# EasyEDA Pro project Link.epro

# Schematic ST-Link_v1_3
Board Name: ST-Link_v1_3; Create Date: 2025-02-25; Page Name: ST-Link; Project Name: ST-Link; Schematic Name: ST-Link_v1_3; Update Date: 2025-02-26
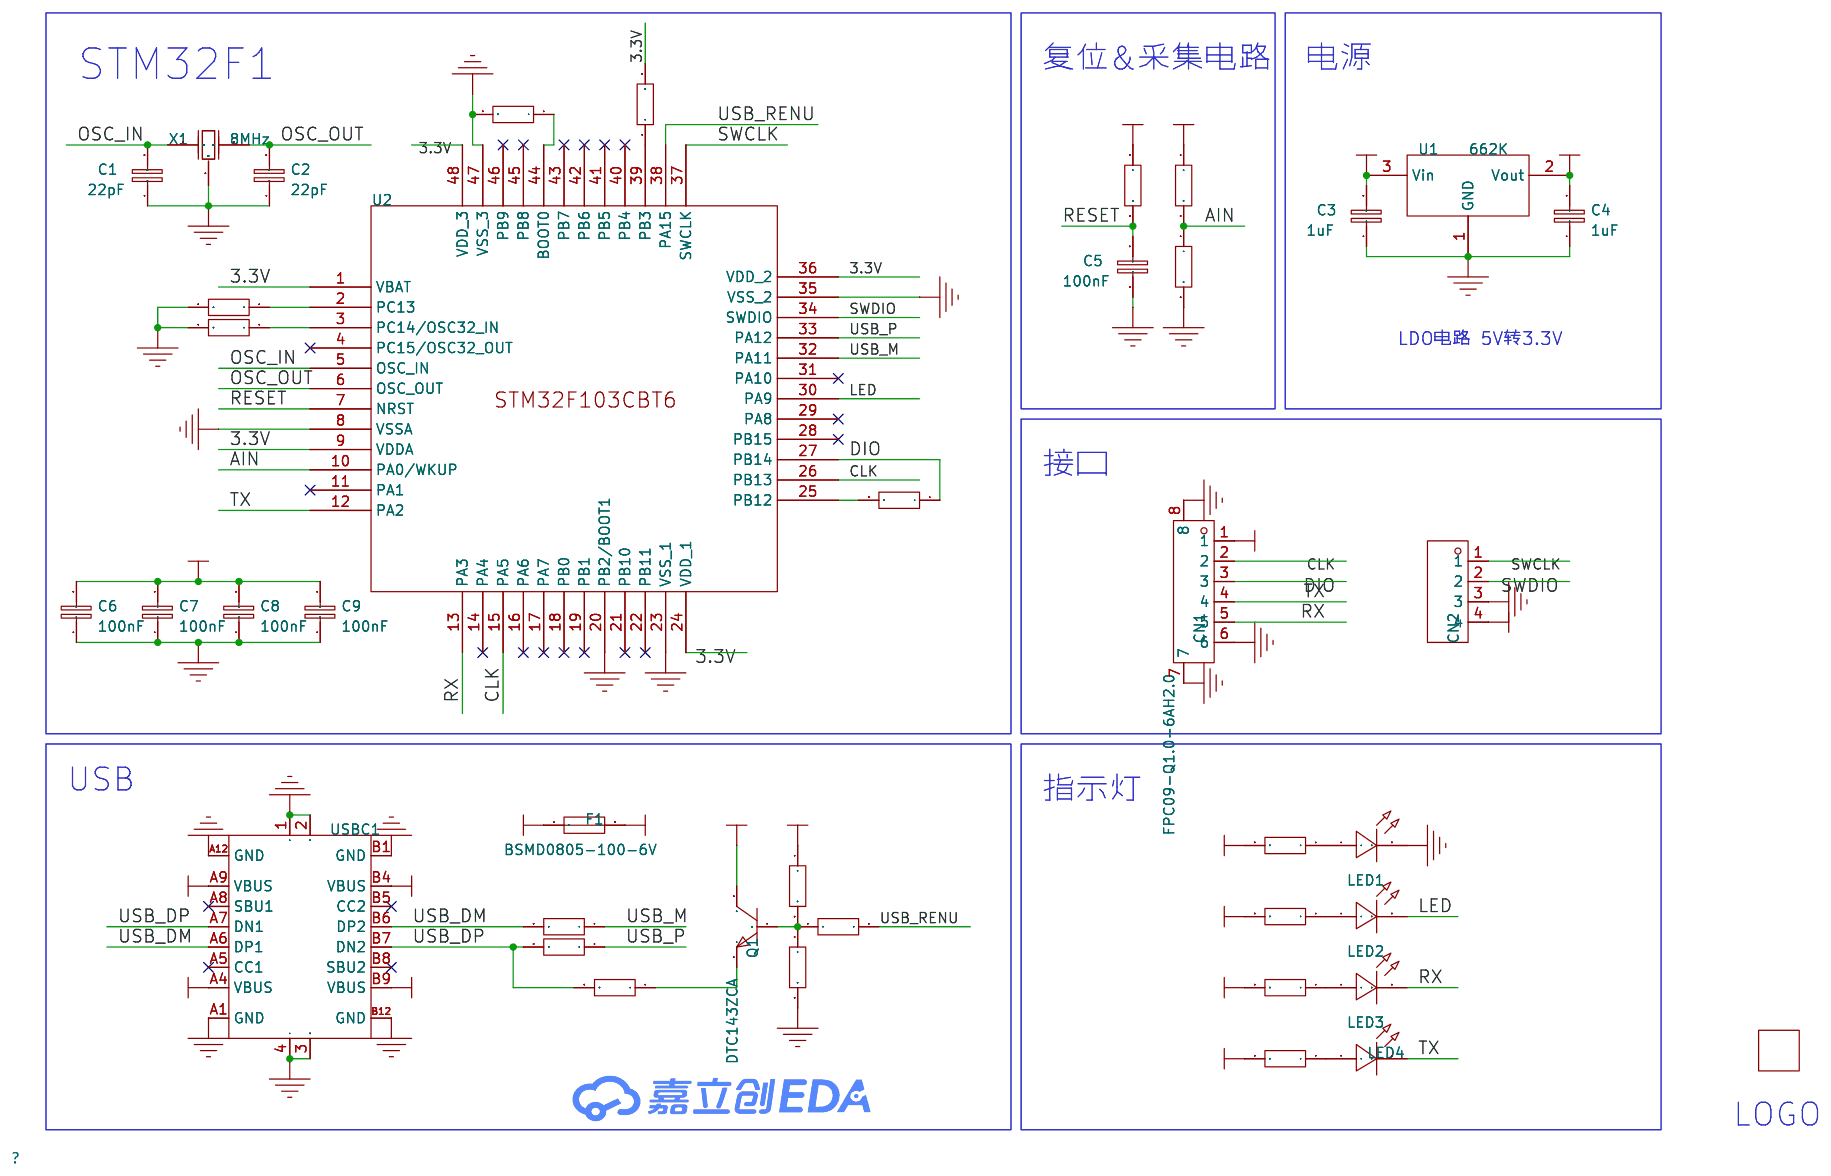
[diagram p0: schematic sheet]

## Parts
C1  22pF  [C0603]
C2  22pF  [C0603]
C3  1uF  [C0603]
C4  1uF  [C0603]
C5  100nF  [C0603]
C6  100nF  [C0603]
C7  100nF  [C0603]
C8  100nF  [C0603]
C9  100nF  [C0603]
CN1  FPC09-Q1.0-6AH2.0  [FPC-SMD_6P-P1.00_XYECONN_FPC09-Q1.0-6AH2.0]
CN2  X6511WRS-04H-C60D48  [HDR-SMD_4P-P2.54-H-M-W13.3-N]
F1  BSMD0805-100-6V  [F0805]
H1  MoonGrt  [MoonGrt]  (no BOM)
LED1  LTST-C193TBKT-5A  [LED0603]
LED2  LTST-C193TBKT-5A  [LED0603]
LED3  LTST-C193TBKT-5A  [LED0603]
LED4  LTST-C193TBKT-5A  [LED0603]
Q1  DTC143ZCA  [SOT-23-3_L2.9-W1.3-P1.90-LS2.4-BR]
R1  4.7kΩ  [R0603]
R2  10kΩ  [R0603]
R3  10kΩ  [R0603]
R4  10kΩ  [R0603]
R5  10kΩ  [R0603]
R6  10kΩ  [R0603]
R7  10kΩ  [R0603]
R8  100Ω  [R0603]
R9  1kΩ  [R0603]
R10  10kΩ  [R0603]
R11  22Ω  [R0603]
R12  22Ω  [R0603]
R13  100Ω  [R0603]
R14  1kΩ  [R0603]
R15  36kΩ  [R0603]
R16  1.5kΩ  [R0603]
R17  1kΩ  [R0603]
R18  1kΩ  [R0603]
U1  662K  [SOT-23-3_L2.9-W1.3-P1.90-LS2.4-BR]
U2  STM32F103CBT6  [LQFP-48_L7.0-W7.0-P0.50-LS9.0-BL]
USBC1  TYPE-C-31-M-12  [USB-C_SMD-TYPE-C-31-M-12]
X1  8MHz  [OSC-SMD_3P-L3.2-W1.3-P1.20-L]

## Library data of the parts
C1 C2 = CL10C220JB8NNNC: 容值:22pF;精度:±5%;额定电压:50V;材质(温度系数):C0G;; LCSC Part Name: 22pF ±5% 50V; Supplier Part: C1653; Manufacturer: SAMSUNG(三星); Supplier Footprint: 0603; JLCPCB Part Class: Basic Part; Datasheet: https://atta.szlcsc.com/upload/public/pdf/source/20160218/1457707763339.pdf; Supplier: LCSC; Tolerance: ±5%; Voltage Rated: 50V; Temperature Coefficient: C0G
C3 C4 C6-C9 = CL10A106KP8NNNC: 容值:10uF;精度:±10%;额定电压:10V;材质(温度系数):X5R;; LCSC Part Name: 10uF ±10% 10V; Supplier Part: C19702; Manufacturer: SAMSUNG(三星); Supplier Footprint: 0603; JLCPCB Part Class: Basic Part; Datasheet: https://atta.szlcsc.com/upload/public/pdf/source/20160218/1457707763339.pdf; Supplier: LCSC; Tolerance: ±10%; Voltage Rated: 10V; Temperature Coefficient: X5R
C5 = CC0603KRX7R9BB104: 容值:100nF;精度:±10%;额定电压:50V;材质(温度系数):X7R;; LCSC Part Name: 100nF ±10% 50V; Supplier Part: C14663; Manufacturer: YAGEO(国巨); Supplier Footprint: 0603; JLCPCB Part Class: Basic Part; Datasheet: https://atta.szlcsc.com/upload/public/pdf/source/20180910/C282072_33301C7F631E79921B82A8DAC6BCC5B3.pdf; Supplier: LCSC; Tolerance: ±10%; Voltage Rated: 50V; Temperature Coefficient: X7R
CN1 = FPC09-Q1.0-6AH2.0: 锁定特性:翻盖式;触点类型:下接;触点数量:6P;间距:1mm;安装类型:卧贴;; LCSC Part Name: 间距:1mm P数:6P 翻盖式 下接; Supplier Part: C19269921; Manufacturer: XYECONN(辛译); Supplier Footprint: SMD,P=1mm,卧贴; JLCPCB Part Class: Extended Part; Datasheet: https://atta.szlcsc.com/upload/public/pdf/source/20231122/290E50ABEF878A57FE1C34FD27D651A8.pdf; Supplier: LCSC; Locking Feature: 翻盖式; Contact Type: 下接; Number of Contacts: 6P; Pitch: 1mm; Mounting Type: 卧贴; Height Above Board: 2mm
CN2 = X6511WRS-04H-C60D48: 插针结构:1x4P;间距:2.54mm;行距:2.54mm;圆针/方针:方针;安装类型:-;排数:单排;总PIN位数:4P;额定电流:3A;额定电压:250V;配合针长度:-;塑高:2.5mm;端接针长度:-;触头材质:黄铜;触头镀层:金;工作温度范围:-40℃~+105℃;焊接温度(最大值):260℃;颜色:黑色;; LCSC Part Name: 1x4P 间距:2.54mm 方针; Supplier Part: C5242197; Manufacturer: XKB Connection(中国星坤); Supplier Footprint: SMD,P=2.54mm; JLCPCB Part Class: 扩展库; Datasheet: https://atta.szlcsc.com/upload/public/pdf/source/20221103/EADF72CF36CD96D511D8188ACEE72315.pdf; Supplier: LCSC; Pin Structure: 1x4P; Pitch: 2.54mm; Row Spacing: 2.54mm; Circluar Pins/Square Pins: 方针; Number of Rows: 单排; Number of Pins: 4P; Current Rating (Max): 3A; Voltage Rating (Max): 250V; Insulation Height: 2.5mm; Contact Material: 黄铜; Contact Plating: 金; Operating Temperature Range: -40℃~+105℃; Soldering Temperature(Max): 260℃; Color: 黑色
F1 = BSMD0805-100-6V: 最大电压:6V;最大电流:40A;保持电流:1A;跳闸电流:2A;; LCSC Part Name: 6V 1A 0805自恢复; Supplier Part: C883112; Manufacturer: BHFUSE(佰宏); Supplier Footprint: 0805; JLCPCB Part Class: Extended Part; Datasheet: https://atta.szlcsc.com/upload/public/pdf/source/20230512/7A46D6CD923C15CBB98FD769C08EDD80.pdf; Supplier: LCSC; Operating Voltage (Max): 6V; Current Rating (Max): 40A; Hold Current: 1A; Trip Current: 2A; Power Dissipation: 600mW; Resistance - Initial (Ri) (Min): 40mΩ; Resistance - Post Trip (R1) (Max): 270mΩ; Maximum Time to Trip: 300ms; Operating Temperature: -40℃~+85℃
H1 = MoonGrt
LED1-LED4 = LTST-C193TBKT-5A: 发光颜色:蓝色;正向电压(VF):2.8V;功率:76mW;正向电流:5mA;主波长:465nm~475nm;二极管配置:-;透镜颜色:无色透明透镜;色温:-;发光强度:15mcd;发光角度:130°;载带方式:-;工作温度:-20℃~+80℃;; LCSC Part Name: 蓝灯; Supplier Part: C125103; Manufacturer: LITEON(光宝); Supplier Footprint: 0603; JLCPCB Part Class: Extended Part; Datasheet: https://atta.szlcsc.com/upload/public/pdf/source/20171230/C125103_15146280496221222053.pdf; Supplier: LCSC; Emitted Color: 蓝色; Forward Voltage (VF): 2.8V; Power Dissipation: 76mW; Forward Current: 5mA; Dominant Wavelength: 465nm~475nm; Peak Wavelength: 468nm; Lens Color: 无色透明透镜; Luminous Intensity: 15mcd; Viewing Angle: 130°; Operating Temperature: -20℃~+80℃
Q1 = DTC143ZCA_C15236: 晶体管类型:-;集射极击穿电压(Vceo):50V;集电极电流(Ic):100mA;功率(Pd):200mW;直流电流增益(hFE@Ic,Vce):80@10mA,5V;; LCSC Part Name: 耐压:50V 电流:100mA; Supplier Part: C15236; Manufacturer: CJ(江苏长电/长晶); Supplier Footprint: SOT-23; JLCPCB Part Class: Extended Part; Datasheet: https://atta.szlcsc.com/upload/public/pdf/source/20140809/1457707205046.pdf; Supplier: LCSC; Collector-Emitter Breakdown Voltage (Vceo): 50V; Collector Current (Ic): 100mA; Power Dissipation (Pd): 200mW; DC Current Gain (hFE@Ic,Vce): 80@10mA,5V; Input Voltage (VI(on)@Ic,Vce): 1.3V@5mA,0.3V; Input Voltage (VI(off)@Ic,Vce): 500mV; Output Voltage (VO(on)@Io/Ii): 300mV@5mA,0.25mA; Input Resistor: 6.11kΩ; Operating Temperature: -55℃~+150℃
R1 = 0603WAF4701T5E: 电阻类型:厚膜电阻;阻值:4.7kΩ;精度:±1%;功率:100mW;最大工作电压:75V;温度系数:±100ppm/℃;; LCSC Part Name: 4.7kΩ ±1% 100mW 厚膜电阻; Supplier Part: C23162; Manufacturer: UNI-ROYAL(厚声); Supplier Footprint: 0603; JLCPCB Part Class: Basic Part; Datasheet: https://atta.szlcsc.com/upload/public/pdf/source/20200306/C422600_1E6D84923E4A46A82E41ADD87F860B5C.pdf; Supplier: LCSC; Type: 厚膜电阻; Tolerance: ±1%; Power(Watts): 100mW; Overload Voltage (Max): 75V; Temperature Coefficient: ±100ppm/℃; Operating Temperature Range: -55℃~+155℃
R2-R7 R10 = 0603WAF1002T5E: 电阻类型:厚膜电阻;阻值:10kΩ;精度:±1%;功率:100mW;最大工作电压:75V;温度系数:±100ppm/℃;; LCSC Part Name: 厚膜电阻 10kΩ ±1% 100mW; Supplier Part: C25804; Manufacturer: UNI-ROYAL(厚声); Supplier Footprint: 0603; JLCPCB Part Class: Basic Part; Datasheet: https://atta.szlcsc.com/upload/public/pdf/source/20200306/C422600_1E6D84923E4A46A82E41ADD87F860B5C.pdf; Supplier: LCSC; Type: 厚膜电阻; Tolerance: ±1%; Power(Watts): 100mW; Overload Voltage (Max): 75V; Temperature Coefficient: ±100ppm/℃; Operating Temperature Range: -55℃~+155℃
R8 R13 = 0603WAF1000T5E: 电阻类型:厚膜电阻;阻值:100Ω;精度:±1%;功率:100mW;最大工作电压:75V;温度系数:±200ppm/℃;; LCSC Part Name: 100Ω ±1% 100mW 厚膜电阻; Supplier Part: C22775; Manufacturer: UNI-ROYAL(厚声); Supplier Footprint: 0603; JLCPCB Part Class: Basic Part; Datasheet: https://atta.szlcsc.com/upload/public/pdf/source/20200306/C422600_1E6D84923E4A46A82E41ADD87F860B5C.pdf; Supplier: LCSC; Type: 厚膜电阻; Tolerance: ±1%; Power(Watts): 100mW; Overload Voltage (Max): 75V; Temperature Coefficient: ±200ppm/℃; Operating Temperature Range: -55℃~+155℃
R9 R14 R17 R18 = 0603WAF1001T5E: 电阻类型:厚膜电阻;阻值:1kΩ;精度:±1%;功率:100mW;最大工作电压:75V;温度系数:±100ppm/℃;; LCSC Part Name: 1kΩ ±1% 100mW 厚膜电阻; Supplier Part: C21190; Manufacturer: UNI-ROYAL(厚声); Supplier Footprint: 0603; JLCPCB Part Class: Basic Part; Datasheet: https://atta.szlcsc.com/upload/public/pdf/source/20200306/C422600_1E6D84923E4A46A82E41ADD87F860B5C.pdf; Supplier: LCSC; Type: 厚膜电阻; Tolerance: ±1%; Power(Watts): 100mW; Overload Voltage (Max): 75V; Temperature Coefficient: ±100ppm/℃; Operating Temperature Range: -55℃~+155℃
R11 R12 = 0603WAF220JT5E: 电阻类型:厚膜电阻;阻值:22Ω;精度:±1%;功率:100mW;最大工作电压:75V;温度系数:±100ppm/℃;; LCSC Part Name: 22Ω ±1% 100mW 厚膜电阻; Supplier Part: C23345; Manufacturer: UNI-ROYAL(厚声); Supplier Footprint: 0603; JLCPCB Part Class: Basic Part; Datasheet: https://atta.szlcsc.com/upload/public/pdf/source/20200306/C422600_1E6D84923E4A46A82E41ADD87F860B5C.pdf; Supplier: LCSC; Type: 厚膜电阻; Tolerance: ±1%; Power(Watts): 100mW; Overload Voltage (Max): 75V; Temperature Coefficient: ±100ppm/℃; Operating Temperature Range: -55℃~+155℃
R15 = 0603WAF3602T5E: 电阻类型:厚膜电阻;阻值:36kΩ;精度:±1%;功率:100mW;最大工作电压:75V;温度系数:±100ppm/℃;; LCSC Part Name: 36kΩ ±1% 100mW 厚膜电阻; Supplier Part: C23147; Manufacturer: UNI-ROYAL(厚声); Supplier Footprint: 0603; JLCPCB Part Class: Extended Part; Datasheet: https://atta.szlcsc.com/upload/public/pdf/source/20200306/C422600_1E6D84923E4A46A82E41ADD87F860B5C.pdf; Supplier: LCSC; Type: 厚膜电阻; Tolerance: ±1%; Power(Watts): 100mW; Overload Voltage (Max): 75V; Temperature Coefficient: ±100ppm/℃; Operating Temperature Range: -55℃~+155℃
R16 = 0603WAF1501T5E: 电阻类型:厚膜电阻;阻值:1.5kΩ;精度:±1%;功率:100mW;最大工作电压:75V;温度系数:±100ppm/℃;; LCSC Part Name: 1.5kΩ ±1% 100mW 厚膜电阻; Supplier Part: C22843; Manufacturer: UNI-ROYAL(厚声); Supplier Footprint: 0603; JLCPCB Part Class: Basic Part; Datasheet: https://atta.szlcsc.com/upload/public/pdf/source/20200306/C422600_1E6D84923E4A46A82E41ADD87F860B5C.pdf; Supplier: LCSC; Type: 厚膜电阻; Tolerance: ±1%; Power(Watts): 100mW; Overload Voltage (Max): 75V; Temperature Coefficient: ±100ppm/℃; Operating Temperature Range: -55℃~+155℃
U1 = 662K: 输出类型:固定;最大输入电压:8V;输出电压:3.3V;最大输出电流:300mA;输出极性:正极;; LCSC Part Name: 662K. 输入8V 300mA; Supplier Part: C7470756; Manufacturer: HXY MOSFET(华轩阳电子); Supplier Footprint: SOT-23; JLCPCB Part Class: Extended Part; Datasheet: https://atta.szlcsc.com/upload/public/pdf/source/20230915/BA72989D17401E2852D389BF12EDF43F.pdf; Supplier: LCSC; Output Type: 固定; Maximum Input Voltage: 8V; Output Voltage: 3.3V; MAX Output Current: 300mA; Output Polarity: 正极; Number of Outputs: 1; Design Item ID: LM317; Library Name: fly
U2 = STM32F103CBT6: CPU内核:ARM-M3;CPU最大主频:72MHz;应用领域:-;; LCSC Part Name: 主流增强型ARM Cortex-M3 MCU，具有128 KB Flash、72 MHz CPU、电机控制、USB和CAN; Supplier Part: C8304; Manufacturer: ST(意法半导体); Supplier Footprint: LQFP-48(7x7); JLCPCB Part Class: Extended Part; Datasheet: https://atta.szlcsc.com/upload/public/pdf/source/20150811/1457707344439.pdf; Supplier: LCSC; CPU Core: ARM-M3; CPU Maximum Speed: 72MHz; Program Storage Size: 128KB; Program Memory Type: FLASH; Number of I/O: 37; ADC (Bit): 12bit; Low Voltage Detection Threshold: 2V~3.6V
USBC1 = TYPE-C-31-M-12: 连接器类型:Type-C;标准:-;公母:母;安装方式:-;触点数量:16P;端口数量:1;额定电流 - 电源:5A;工作温度范围:-;; LCSC Part Name: Type-C 母; Supplier Part: C165948; Manufacturer: 韩国韩荣; Supplier Footprint: SMD; JLCPCB Part Class: Extended Part; Datasheet: https://atta.szlcsc.com/upload/public/pdf/source/20220525/466408E853115E789EDB0DDC29077C05.pdf; Supplier: LCSC; Connector Type: Type-C; Gender: 母; Number of Contacts: 16P; Number of Ports: 1; Current Rating - Power (Max): 5A
X1 = CSTNE8M00GH5C000R0: 频率:8MHz;内置负载电容:33pF;谐振阻抗:40Ω;; LCSC Part Name: 8MHz ±0.07% 内置负载电容:33pF; Supplier Part: C341525; Manufacturer: muRata(村田); Supplier Footprint: SMD3213-3P; JLCPCB Part Class: Extended Part; Datasheet: https://atta.szlcsc.com/upload/public/pdf/source/20181211/C341525_832BA077079E4863A5153C1DB98581D5.pdf; Supplier: LCSC; Built-in Load Capacitance: 33pF; Resonant Impedance: 40Ω; Operating Temperature: -40℃~+125℃

## Nets
3.3V: C4.2 C6.2 C7.2 C8.2 C9.2 CN1.1 CN2.4 Q1.3(C) R1.2 R3.1 R4.1 R9.2 R14.2 R17.2 R18.2 U1.2(Vout) U2.1(VBAT) U2.9(VDDA) U2.24(VDD_1) U2.36(VDD_2) U2.48(VDD_3)
5V: C3.2 F1.2 R10.1 U1.3(Vin)
GND: C1.1 C2.1 C3.1 C4.1 C5.1 C6.1 C7.1 C8.1 C9.1 CN1.6 CN1.7 CN1.8 CN2.3 LED1.2 R2.2 R5.2 R6.2 R7.2 R15.2 U1.1(GND) U2.8(VSSA) U2.20(PB2/BOOT1) U2.23(VSS_1) U2.35(VSS_2) U2.47(VSS_3) USBC1.1 USBC1.2 USBC1.3 USBC1.4 USBC1.A1(GND) USBC1.A12(GND) USBC1.B1(GND) USBC1.B12(GND) X1.2(GND)
VBUS: F1.1 USBC1.A4(VBUS) USBC1.A9(VBUS) USBC1.B4(VBUS) USBC1.B9(VBUS)
AIN: R4.2 R5.1 U2.10(PA0/WKUP)
CLK: CN1.2 U2.15(PA5) U2.26(PB13)
DIO: CN1.3 R8.1 U2.27(PB14)
LED: LED2.2 U2.30(PA9)
OSC_IN: C1.2 U2.5(OSC_IN) X1.3(OSC2)
OSC_OUT: C2.2 U2.6(OSC_OUT) X1.1(OSC1)
RESET: C5.2 R3.2 U2.7(NRST)
RX: CN1.5 LED3.2 U2.13(PA3)
SWCLK: CN2.1 U2.37(SWCLK)
SWDIO: CN2.2 U2.34(SWDIO)
TX: CN1.4 LED4.2 U2.12(PA2)
USB_DM: R11.2 USBC1.A6(DP1) USBC1.B6(DP2)
USB_DP: R12.2 R16.2 USBC1.A7(DN1) USBC1.B7(DN2)
USB_M: R11.1 U2.32(PA11)
USB_P: R12.1 U2.33(PA12)
USB_RENU: R13.2 U2.38(PA15)
$2N32655: R6.1 U2.2(PC13)
$2N32685: Q1.2(E) R16.1
$2N32778: R8.2 U2.25(PB12)
$2N32800: R2.1 U2.44(BOOT0)
$2N32802: R1.1 U2.39(PB3)
$2N32803: R7.1 U2.3(PC14/OSC32_IN)
$2N32831: Q1.1(B) R10.2 R13.1 R15.1
$2N38015: LED1.1 R9.1
$2N38044: LED2.1 R14.1
$2N38073: LED3.1 R17.1
$2N38102: LED4.1 R18.1

Not connected (* = marked no-connect by the designer): U2 4(PC15/OSC32_OUT)* 11(PA1)* 14(PA4)* 16(PA6)* 17(PA7)* 18(PB0)* 19(PB1)* 21(PB10)* 22(PB11)* 28(PB15)* 29(PA8)* 31(PA10)* 40(PB4)* 41(PB5)* 42(PB6)* 43(PB7)* 45(PB8)* 46(PB9)*; USBC1 A5(CC1)* A8(SBU1)* B5(CC2)* B8(SBU2)*

## Notes on the sheet
- STM32F1
- 复位&采集电路
- 电源
- LDO电路 5V转3.3V
- 接口
- USB
- 指示灯
- LOGO

# Board ST-Link_v1_3
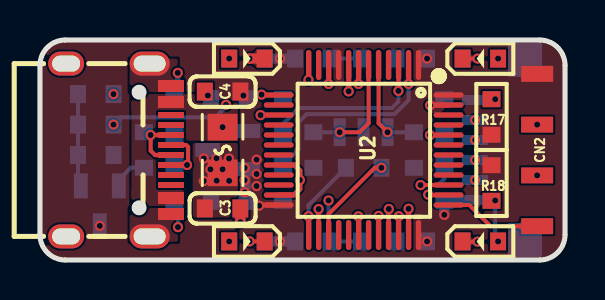
[diagram p1: board, top side]
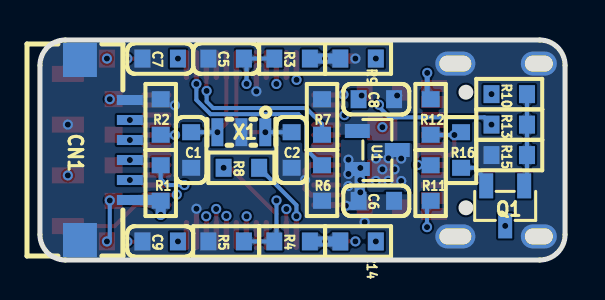
[diagram p2: board, bottom side, seen from below]

Outline 26.29 x 11 mm; copper layers: Top Layer, Inner1, Inner2, Bottom Layer. Coordinates in mm from the lower left corner of the outline.
Outline path: 0,9.73 0,1.27 arc(0.37,0.37) 1.27,0 25.02,0 arc(25.92,0.37) 26.29,1.27 26.29,9.73 arc(25.92,10.63) 25.02,11 1.27,11 arc(0.37,10.63) 0,9.73
Stack: Top Layer 0.035mm 外层铜厚1oz / Dielectric1 0.2104mm 7628 RC49% 8.6mil / Inner1 0.0152mm 内层铜厚 / Dielectric2 1.065mm 1.1mm H/HOZ Copper / Inner2 0.0152mm 内层铜厚 / Dielectric3 0.2104mm 7628 RC49% 8.6mil / Bottom Layer 0.035mm 外层铜厚1oz

## Design rules (mm)
net USB_P: DP1
net USB_M: DP1
template: MoonGrt
spacing Default (default): track to track 0.102, other pairs 0 to 0.102
track width Default (default): min 0.102, default 0.203, max 25.4
track width PWR: min 0.102, default 0.508, max 2.54
differential pair differentialPair (default): width min 0.127, default 0.254, max 2.54; gap min 0.152, default 0.152
via Default (default): diameter min 0.508, default 0.508, max 100.025; hole min 0.305, default 0.305, max 59.995
net GND uses PWR
net 5V uses PWR
net 3.3V uses PWR
net VBUS uses PWR

## Placement (name value [footprint] x y rotation side)
C1  22pF  [C0603]  18.72 5.5 90 bottom
C2  22pF  [C0603]  13.69 5.5 90 bottom
C3  1uF  [C0603]  9.14 2.58 180 top
C4  1uF  [C0603]  9.14 8.42 0 top
C5  100nF  [C0603]  16.97 10.07 180 bottom
C6  100nF  [C0603]  9.45 2.96 0 bottom
C7  100nF  [C0603]  20.27 10.07 180 bottom
C8  100nF  [C0603]  9.45 8.04 0 bottom
C9  100nF  [C0603]  20.27 0.93 180 bottom
CN1  FPC09-Q1.0-6AH2.0  [FPC-SMD_6P-P1.00_XYECONN_FPC09-Q1.0-6AH2.0]  22.99 5.5 90 bottom
CN2  X6511WRS-04H-C60D48  [HDR-SMD_4P-P2.54-H-M-W13.3-N]  24.89 5.5 90 top
F1  BSMD0805-100-6V  [F0805]  9.14 5.5 270 top
H1  -  [MoonGrt]  2.41 5.5 90 top
LED1  LTST-C193TBKT-5A  [LED0603]  10.36 10.07 0 top
LED2  LTST-C193TBKT-5A  [LED0603]  10.36 0.93 0 top
LED3  LTST-C193TBKT-5A  [LED0603]  22.05 10.07 180 top
LED4  LTST-C193TBKT-5A  [LED0603]  22.05 0.93 180 top
Q1  DTC143ZCA  [SOT-23-3_L2.9-W1.3-P1.90-LS2.4-BR]  3 2.71 90 bottom
R1  4.7kΩ  [R0603]  20.24 3.85 270 bottom
R2  10kΩ  [R0603]  20.24 7.15 90 bottom
R3  10kΩ  [R0603]  13.67 10.07 0 bottom
R4  10kΩ  [R0603]  13.67 0.93 0 bottom
R5  10kΩ  [R0603]  16.97 0.93 0 bottom
R6  10kΩ  [R0603]  12.17 3.85 270 bottom
R7  10kΩ  [R0603]  12.17 7.15 90 bottom
R8  100Ω  [R0603]  16.21 4.61 180 bottom
R9  1kΩ  [R0603]  10.36 10.07 0 bottom
R10  10kΩ  [R0603]  2.79 8.29 180 bottom
R11  22Ω  [R0603]  6.73 3.85 90 bottom
R12  22Ω  [R0603]  6.73 7.15 270 bottom
R13  100Ω  [R0603]  2.79 6.77 0 bottom
R14  1kΩ  [R0603]  10.36 0.93 0 bottom
R15  36kΩ  [R0603]  2.79 5.25 0 bottom
R16  1.5kΩ  [R0603]  5.21 5.5 90 bottom
R17  1kΩ  [R0603]  22.61 7.15 270 top
R18  1kΩ  [R0603]  22.61 3.85 90 top
U1  662K  [SOT-23-3_L2.9-W1.3-P1.90-LS2.4-BR]  9.4 5.5 0 bottom
U2  STM32F103CBT6  [LQFP-48_L7.0-W7.0-P0.50-LS9.0-BL]  16.21 5.5 180 top
USBC1  TYPE-C-31-M-12  [USB-C_SMD-TYPE-C-31-M-12]  3.94 5.5 270 top
X1  8MHz  [OSC-SMD_3P-L3.2-W1.3-P1.20-L]  16.21 6.39 0 bottom

## Footprints (pads in the part's own frame, mm; a bottom-side part is the same pattern mirrored in y, then rotated)
C0603
  rect 0.8x0.9 smd: 1(-0.889,0) 2(0.889,0)
F0805
  rect 1.335x1.5 smd: 1(-1.143,0) 2(1.143,0)
FPC-SMD_6P-P1.00_XYECONN_FPC09-Q1.0-6AH2.0
  rect 0.5x1.3 smd: 1(-2.5,-1.2) 2(-1.5,-1.2) 3(-0.5,-1.2) 4(0.5,-1.2) 5(1.5,-1.2) 6(2.5,-1.2)
  rect 1.7x1.7 smd: 7(4.5,1.3) 8(-4.5,1.3)
HDR-SMD_4P-P2.54-H-M-W13.3-N
  rect 0.8x1.6 smd: 1(-3.81,0) 2(-1.27,0) 3(1.27,0) 4(3.81,0)
LED0603
  rect 0.8x0.9 smd: 1(-0.889,0) 2(0.888,0)
LQFP-48_L7.0-W7.0-P0.50-LS9.0-BL
  oval 0.27x1.5 smd: 1(-2.75,-4.25) 2(-2.25,-4.25) 3(-1.75,-4.25) 4(-1.25,-4.25) 5(-0.75,-4.25) 6(-0.25,-4.25) 7(0.25,-4.25) 8(0.75,-4.25) 9(1.25,-4.25) 10(1.75,-4.25) 11(2.25,-4.25) 12(2.75,-4.25) 25(2.75,4.25) 26(2.25,4.25) 27(1.75,4.25) 28(1.25,4.25) 29(0.75,4.25) 30(0.25,4.25) 31(-0.25,4.25) 32(-0.75,4.25) 33(-1.25,4.25) 34(-1.75,4.25) 35(-2.25,4.25) 36(-2.75,4.25)
  oval 1.5x0.27 smd: 13(4.25,-2.75) 14(4.25,-2.25) 15(4.25,-1.75) 16(4.25,-1.25) 17(4.25,-0.75) 18(4.25,-0.25) 19(4.25,0.25) 20(4.25,0.75) 21(4.25,1.25) 22(4.25,1.75) 23(4.25,2.25) 24(4.25,2.75) 37(-4.25,2.75) 38(-4.25,2.25) 39(-4.25,1.75) 40(-4.25,1.25) 41(-4.25,0.75) 42(-4.25,0.25) 43(-4.25,-0.25) 44(-4.25,-0.75) 45(-4.25,-1.25) 46(-4.25,-1.75) 47(-4.25,-2.25) 48(-4.25,-2.75)
OSC-SMD_3P-L3.2-W1.3-P1.20-L
  rect 0.6x1.4 smd: 1(-1.199,0) 2(0,0) 3(1.199,0)
R0603
  rect 0.8x0.9 smd: 1(-0.889,0) 2(0.889,0)
SOT-23-3_L2.9-W1.3-P1.90-LS2.4-BR
  rect 1.25x0.7 smd: 1(1,-0.95) 2(1,0.95) 3(-1,0)
USB-C_SMD-TYPE-C-31-M-12
  oval 1.2x2 hole 0.8x1.6: 1(4.32,1.556) 4(-4.32,1.556)
  oval 1.2x1.8 hole 0.8x1.4: 2(4.32,-2.624) 3(-4.32,-2.624)
  rect 0.3x1.3 smd: A1(-3.35,2.623) A4(-2.55,2.623) A5(-1.25,2.623) A6(-0.25,2.623) A7(0.25,2.623) A8(1.25,2.624) A9(2.55,2.623) A12(3.35,2.623) B1(3.05,2.623) B4(2.25,2.623) B5(1.75,2.623) B6(0.75,2.623) B7(-0.75,2.623) B8(-1.75,2.624) B9(-2.25,2.623) B12(-3.05,2.623)

## Nets
As in the schematic.

Pads without a net: U2 4 11 14 16 17 18 19 21 22 28 29 31 40 41 42 43 45 46; USBC1 A5 A8 B5 B8

## Via types
v1: diameter 0.508, hole 0.305, Top Layer to Bottom Layer, 72 vias

## Routing (per net, layer and track width the routed paths; a pad name or vN(x,y) marks a point on that pad's centre or on a via; arc(x,y) is an arc through that point)
3.3V: length 8.6
  Top Layer w0.254: v1(10.97,2.71) 11.01,2.75 U2.24
  Bottom Layer w0.406: v1(10.97,2.71) 10.58,2.71 10.34,2.96
  Bottom Layer w0.508: v1(20.24,2.26) R1.2 20.28,3 CN1.1 ; R14.2 v1(12.01,0.93) R4.1 ; R9.2 v1(12.02,10.07) R3.1 ; 10.34,2.96 10.29,3.01 10.29,4.36 10.39,4.46
  vias: v1(3,1.71) v1(10.19,8.22) v1(10.25,4.6) v1(10.25,3.99) v1(10.25,3.38) v1(10.85,5.02) v1(10.85,4.3) v1(10.85,3.7) v1(19.38,10.07) v1(19.38,0.93)
5V: length 6.6
  Inner2 w0.762: 8.84,5.18 8.84,5.5 7.1,7.25 4.73,7.25 v1(3.68,8.29)
  vias: v1(8.2,5.07) v1(8.2,3.95) v1(8.53,4.53) v1(8.84,5.09) v1(8.85,3.96) v1(9.14,4.53) v1(9.46,5.08) v1(9.47,3.96)
GND: length 8.3
  Top Layer w0.254: U2.8 v1(15.46,8.43) ; U2.47 19.55,7.75 v1(19.53,7.73) ; v1(18.46,2.56) U2.35 ; U2.23 12.72,3.25 13.01,3.55 v1(13.01,4) 13.01,4.47 12.74,4.75 U2.20
  Top Layer w0.508: LED1.2 v1(10.5,10.07) ; C3.1 v1(10.03,1.89)
  vias: v1(8.41,8.22) v1(24.89,6.77)
VBUS:
  vias: v1(9.14,6.64)
AIN: length 10.4
  Top Layer w0.203: U2.10 14.46,8.8 v1(14.45,8.8)
  Inner2 w0.203: v1(14.45,2.98) 14.45,2.98 v1(14.45,8.8)
  Bottom Layer w0.203: v1(14.45,2.98) 14.45,1.04 R4.2 R5.1
CLK: length 17.7
  Top Layer w0.203: 13.95,1.25 13.95,1.25 v1(13.95,2.55)
  Inner2 w0.203: 11,7.23 11.02,7.26 13.31,7.25 13.95,6.61 v1(13.95,2.55) 14.77,1.73 18.83,1.73 21.11,4 v1(21.79,4)
  vias: v1(11.05,7.24)
DIO: length 9.5
  Top Layer w0.203: U2.27 14.46,2.3 16.76,4.61 v1(17.09,4.61)
  Inner1 w0.203: v1(17.09,4.61) 21.4,4.61 v1(21.79,5)
LED: length 7.9
  Top Layer w0.203: v1(10.5,0.93) 11.25,0.93 LED2.2 ; U2.30 15.96,2.17 v1(15.94,2.18)
  Inner1 w0.203: v1(15.94,2.18) 15.94,1.94 15.49,1.49 10.9,1.49 10.5,1.09 v1(10.5,0.93)
OSC_IN: length 4.9
  Top Layer w0.203: U2.5 16.96,6.84 v1(17.4,6.39)
  Bottom Layer w0.203: C1.2 v1(17.4,6.39)
OSC_OUT: length 5.9
  Top Layer w0.203: v1(15.01,6.39) 16,6.39 16.46,6.84 U2.6
  Bottom Layer w0.203: v1(15.01,6.39) C2.2
RESET: length 3.8
  Top Layer w0.203: v1(15.95,8.8) 15.96,8.81 U2.7
  Bottom Layer w0.203: v1(15.95,8.8) 15.95,9.94 C5.2 R3.2
RX: length 16.6
  Top Layer w0.203: v1(11.09,8.27) 11.11,8.25 U2.13 ; LED3.2 v1(21.91,10.07)
  Inner1 w0.203: v1(21.91,10.07) 21.49,10.07 20.98,9.57 13.25,9.57 11.96,8.27 v1(11.09,8.27)
  Inner2 w0.203: v1(21.79,7) 22.23,7.44 22.23,9.76 v1(21.91,10.07)
SWCLK: length 4.9
  Top Layer w0.203: U2.37 21.5,2.75 22.56,1.69 CN2.1
SWDIO: length 9.6
  Top Layer w0.203: v1(17.97,2.19) 17.96,2.18 U2.34
  Inner1 w0.203: v1(17.97,2.19) 18.35,1.8 23.4,1.8 24.89,3.29 v1(24.89,4.23)
TX: length 18.2
  Top Layer w0.203: v1(13.44,9.01) 13.46,9.02 U2.12 ; LED4.2 21.17,0.92 v1(21.91,0.92)
  Inner1 w0.203: v1(13.44,9.01) 13.44,9.06 13.65,9.26 20.93,9.26 21.33,8.86 21.33,6.46 v1(21.79,6)
  Inner2 w0.203: v1(21.91,0.92) 22.24,1.25 22.24,5.54 v1(21.79,6)
USB_DM: length 3.3
  Top Layer w0.203: USBC1.A6 7.32,5.75 7.42,5.65 7.42,4.8 v1(7.36,4.75) USBC1.B6
  Bottom Layer w0.203: R11.2 6.74,4.75 v1(7.36,4.75)
USB_DP: length 4.1
  Top Layer w0.203: USBC1.B7 v1(5.54,6.25) 5.54,5.47 5.76,5.25 6.56,5.25 USBC1.A7
  Bottom Layer w0.203: R12.2 6.72,6.25 v1(5.54,6.25)
USB_M: length 17.6
  Top Layer w0.203: 16.96,2.2 U2.32
  Inner1 w0.254: v1(6.91,1.64) 6.88,1.67 6.88,4.95 7.59,5.66 12.44,5.66 15.29,2.82 16.52,2.82 17.03,2.31 17.03,2.21
  Bottom Layer w0.203: R11.1 6.91,2.78 v1(6.91,1.64)
  vias: v1(16.95,2.2)
USB_P: length 17.6
  Top Layer w0.203: v1(17.47,2.55) 17.45,2.54 17.45,1.25
  Inner1 w0.254: v1(6.9,9.36) 6.9,6.8 7.64,6.07 12.61,6.07 15.46,3.22 16.69,3.22 17.36,2.55 v1(17.47,2.55)
  Bottom Layer w0.254: R12.1 6.9,8.21 v1(6.9,9.36)
USB_RENU: length 19.1
  Top Layer w0.203: U2.38 19.46,3.25 v1(19.44,3.27)
  Inner1 w0.203: v1(9.32,7.76) 9.32,7.76 12.98,7.76 17.46,3.29 19.42,3.29 v1(19.44,3.27)
  Bottom Layer w0.203: v1(9.32,7.76) 9.32,7.66 8.79,7.13 4.04,7.13 v1(3.68,6.77)
$2N32655: length 10.2
  Top Layer w0.203: U2.2 18.46,8.81 v1(18.46,8.8)
  Bottom Layer w0.203: v1(18.46,8.8) 18.46,8 17.75,7.29 13.35,7.29 12.95,6.9 12.95,5.53 R6.1
$2N32685: length 1.8
  Bottom Layer w0.203: Q1.2 3.95,4.01 4.55,4.61 R16.1
$2N32778: length 4.1
  Top Layer w0.203: v1(13.45,2.19) 13.46,2.18 U2.25
  Bottom Layer w0.203: R8.2 13.45,2.74 v1(13.45,2.19)
$2N32800: length 1.7
  Top Layer w0.203: v1(19.53,6.25) 20.45,6.25 U2.44
  Bottom Layer w0.203: R2.1 20.23,6.25 v1(19.53,6.25)
$2N32802: length 3.4
  Top Layer w0.203: v1(19.05,3.75) 19.06,3.75 U2.39
  Bottom Layer w0.203: v1(19.05,3.75) 19.94,3.75 20.24,4.05 R1.1
$2N32803: length 8.5
  Top Layer w0.203: 17.95,8.41 17.95,9.51 17.98,9.54
  Bottom Layer w0.203: v1(17.94,8.45) 17.94,7.92 17.62,7.6 12.97,7.6 12.17,6.8 R7.1
$2N32831: length 4.6
  Bottom Layer w0.203: Q1.1 1.91,3.85 R15.1 R13.1 R10.2
$2N38015:
  vias: v1(9.47,10.07)
$2N38044:
  vias: v1(9.47,0.93)
$2N38073: length 2.1
  Inner2 w0.203: v1(22.94,10.07) 22.94,8.18 v1(22.79,8.04)
$2N38102: length 2.1
  Bottom Layer w0.203: v1(22.94,0.93) 22.79,1.07 v1(22.79,2.98)

## Copper pours and planes (outline as drawn; the poured copper is in the pictures)
3.3V on Top Layer: 0,11 26.29,11 26.29,0 0,0
3.3V on Bottom Layer: 9.77,6.16 11.23,6.16 11.23,2.46 9.77,2.46
3.3V on Inner2: 9.9,6.82 11.63,6.82 11.63,2.33 9.9,2.33
5V on Top Layer: 7.65,5.85 9.9,5.85 9.9,2.12 7.65,2.12
5V on Bottom Layer: 7.65,5.85 9.9,5.85 9.9,3.39 7.65,3.39
5V on Inner2: 7.87,5.99 9.91,5.99 9.91,3.65 7.87,3.65
GND on Top Layer: 4.49,10.07 6.9,10.07 6.9,8.4 4.49,8.4
GND on Top Layer: 4.49,2.6 6.91,2.6 6.91,0.91 4.49,0.91
GND on Bottom Layer: 0,11 26.29,11 26.29,0 0,0
VBUS on Top Layer: 4.58,3.6 7.2,3.6 7.2,2.7 4.58,2.7
VBUS on Top Layer: 4.58,8.28 5.92,8.28 5.92,2.71 4.58,2.71
VBUS on Top Layer: 8.38,7.88 9.9,7.88 9.9,5.97 8.38,5.97
VBUS on Top Layer: 6.55,8.3 8.65,8.3 8.65,5.97 6.55,5.97
VBUS on Top Layer: 4.58,8.3 7.2,8.3 7.2,7.4 4.58,7.4

Small or netless copper shapes (teardrops, artwork), in the pictures only: 59 on Top Layer, 50 on Bottom Layer, 11 on Inner1, 12 on Inner2
